# Altium schematic sheet PAsignal Genrator.SchDoc
size A3; DocumentNumber: 4; SheetNumber: 4; SheetTotal: 7
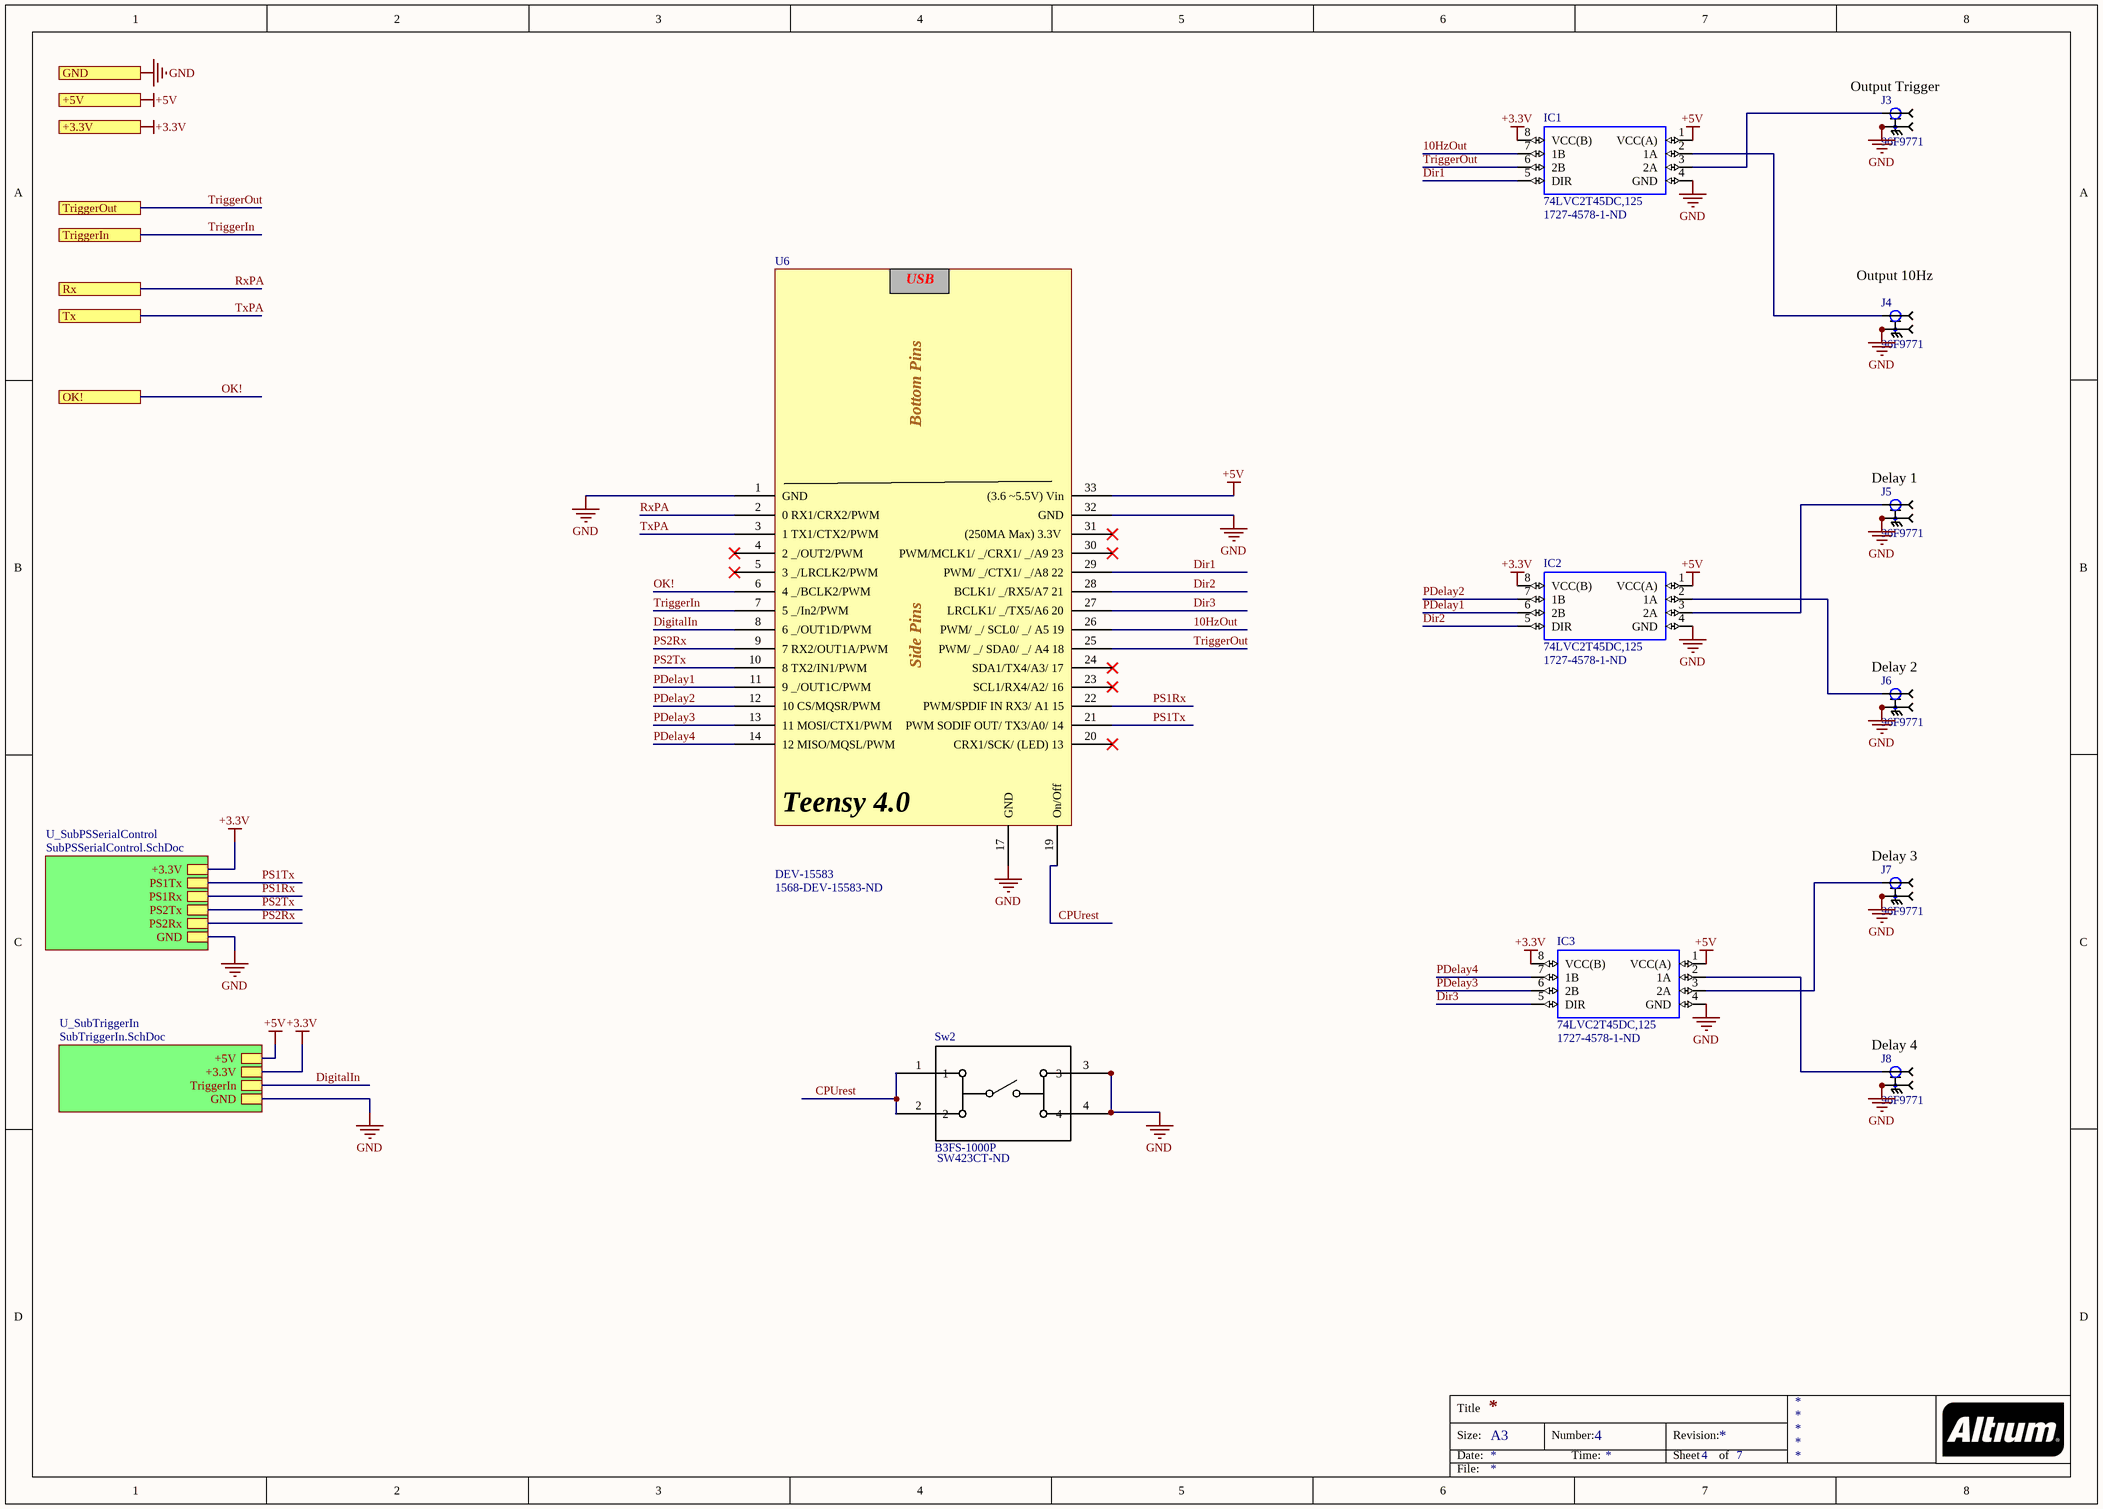
[diagram p0: PAsignal Genrator.SchDoc]

## Parts
IC1  74LVC2T45DC,125  Supplier Part Number 1: 1727-4578-1-ND  [SOP50P310X100-8N]
IC2  74LVC2T45DC,125  Supplier Part Number 1: 1727-4578-1-ND  [SOP50P310X100-8N]
IC3  74LVC2T45DC,125  Supplier Part Number 1: 1727-4578-1-ND  [SOP50P310X100-8N]
J3  Supplier Part Number 1: 96F9771  [SMBboardEdge]  (hidden comment: 131-3701-801)
J4  Supplier Part Number 1: 96F9771  [SMBboardEdge]  (hidden comment: 131-3701-801)
J5  Supplier Part Number 1: 96F9771  [SMBboardEdge]  (hidden comment: 131-3701-801)
J6  Supplier Part Number 1: 96F9771  [SMBboardEdge]  (hidden comment: 131-3701-801)
J7  Supplier Part Number 1: 96F9771  [SMBboardEdge]  (hidden comment: 131-3701-801)
J8  Supplier Part Number 1: 96F9771  [SMBboardEdge]  (hidden comment: 131-3701-801)
Sw2  B3FS-1000P  Supplier Part Number 1: SW423CT-ND  [B3FS-1000P]
U6  DEV-15583  Supplier Part Number 1: 1568-DEV-15583-ND  [Teensy 4.0sideOnly]

## Sub-sheets
U_SubPSSerialControl = SubPSSerialControl.SchDoc: +3.3V, PS1Tx, PS1Rx, PS2Tx, PS2Rx, GND
U_SubTriggerIn = SubTriggerIn.SchDoc: +5V, GND, +3.3V, TriggerIn

## Ports
+3.3V, +5V, GND, OK!, Rx, TriggerIn, TriggerOut, Tx

## Nets
+3.3V: IC1.8(VCC(B)) IC2.8(VCC(B)) IC3.8(VCC(B)) ; port +3.3V, sheet U_SubPSSerialControl/+3.3V, sheet U_SubTriggerIn/+3.3V
+5V: IC1.1(VCC(A)) IC2.1(VCC(A)) IC3.1(VCC(A)) U6.33((3.6_~5.5V)_Vin) ; port +5V, sheet U_SubTriggerIn/+5V
GND: IC1.4(GND) IC2.4(GND) IC3.4(GND) J3.SH1 J3.SH2 J3.SH3 J3.SH4 J4.SH1 J4.SH2 J4.SH3 J4.SH4 J5.SH1 J5.SH2 J5.SH3 J5.SH4 J6.SH1 J6.SH2 J6.SH3 J6.SH4 J7.SH1 J7.SH2 J7.SH3 J7.SH4 J8.SH1 J8.SH2 J8.SH3 J8.SH4 Sw2.3 Sw2.4 U6.1(GND) U6.17(GND) U6.32(GND) ; port GND, sheet U_SubPSSerialControl/GND, sheet U_SubTriggerIn/GND
10HzOut: IC1.7(1B) U6.26(PWM/__/_SCL0/__/_A5_19)
CPUrest: Sw2.1 Sw2.2 U6.19(On/Off)
DigitalIn: U6.8(6__/OUT1D/PWM) ; sheet U_SubTriggerIn/TriggerIn
Dir1: IC1.5(DIR) U6.29(PWM/__/CTX1/__/A8_22)
Dir2: IC2.5(DIR) U6.28(BCLK1/__/RX5/A7_21)
Dir3: IC3.5(DIR) U6.27(LRCLK1/__/TX5/A6_20)
OK!: U6.6(4__/BCLK2/PWM) ; port OK!
PDelay1: IC2.6(2B) U6.11(9__/OUT1C/PWM)
PDelay2: IC2.7(1B) U6.12(10_CS/MQSR/PWM)
PDelay3: IC3.6(2B) U6.13(11_MOSI/CTX1/PWM)
PDelay4: IC3.7(1B) U6.14(12_MISO/MQSL/PWM)
PS1Rx: U6.22(PWM/SPDIF_IN_RX3/_A1_15) ; sheet U_SubPSSerialControl/PS1Rx
PS1Tx: U6.21(PWM_SODIF_OUT/_TX3/A0/_14) ; sheet U_SubPSSerialControl/PS1Tx
PS2Rx: U6.9(7_RX2/OUT1A/PWM) ; sheet U_SubPSSerialControl/PS2Rx
PS2Tx: U6.10(8_TX2/IN1/PWM) ; sheet U_SubPSSerialControl/PS2Tx
RxPA: U6.2(0_RX1/CRX2/PWM) ; port Rx
TriggerIn: U6.7(5__/In2/PWM) ; port TriggerIn
TriggerOut: IC1.6(2B) U6.25(PWM/__/_SDA0/__/_A4_18) ; port TriggerOut
TxPA: U6.3(1_TX1/CTX2/PWM) ; port Tx
NetIC1_2: IC1.2(1A) J4.1
NetIC1_3: IC1.3(2A) J3.1
NetIC2_2: IC2.2(1A) J6.1
NetIC2_3: IC2.3(2A) J5.1
NetIC3_2: IC3.2(1A) J8.1
NetIC3_3: IC3.3(2A) J7.1

Not connected (* = marked no-connect by the designer): U6 4(2__/OUT2/PWM)* 5(3__/LRCLK2/PWM)* 20(CRX1/SCK/_(LED)_13)* 23(SCL1/RX4/A2/_16)* 24(SDA1/TX4/A3/_17)* 30(PWM/MCLK1/__/CRX1/__/A9_23)* 31((250MA_Max)_3.3V_)*

## Notes on the sheet
- (near J3) Output Trigger
- (near J4) Output 10Hz
- (near J5) Delay 1
- (near J6) Delay 2
- (near J7) Delay 3
- (near J8) Delay 4
- Title
- Size:
- Date:
- A3
- Number:
- Time:
- Revision:
- Sheet
- of
- File:
- (in symbol Teensy 4.0_SideOnly) USB; Bottom Pins; Side Pins; Teensy 4.0

## Library data of the parts
IC1-IC3 = 74LVC2T45DC,125: Voltage Level Translator Bidirectional 1 Circuit 2 Channel 420Mbps 8-VSSOP; MF: Nexperia USA; MP: 74LVC2T45DC,125; Value: *; Availability: Good; Package: VSSOP8-8 Nexperia USA Inc.; Check_prices: https://www.snapeda.com/parts/74LVC2T45DC,125/Nexperia/view-part/287401/?ref=eda; Price: None; SnapEDA_Link: https://www.snapeda.com/parts/74LVC2T45DC,125/Nexperia/view-part/287401/?ref=snap; Purchase-URL: https://pricing.snapeda.com/search/part/74LVC2T45DC,125/?ref=eda; Supplier 1: Digi-Key
J3-J8 = SMB: SMB Connector Jack, Male Pin 50Ohm Board Edge, End Launch Solder; Supplier 1: Newark
Sw2 = B3FS-1000P: Tactile Switch SPST-NO Top Actuated Surface Mount; Supplier 1: Digi-Key
U6 = Teensy 4.0_SideOnly: Supplier 1: Digi-Key